# Altium project 3V3 Regulator Breakout.PrjPcb
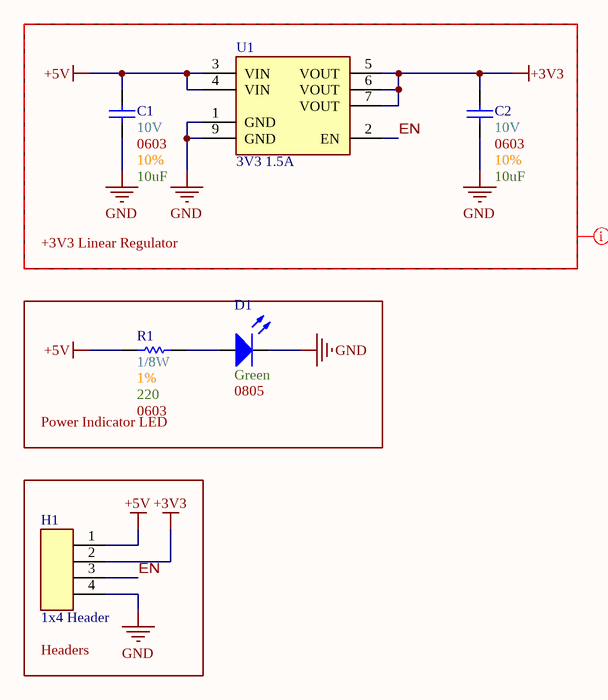
[diagram p0: Regulator.SchDoc]
1 sheet, 6 parts. Net scope: global (net labels, ports and power ports of the same name join across sheets).
Board file: Main.PcbDoc

## Sheet Regulator.SchDoc
size A; SheetNumber: 1; SheetTotal: 1

### Parts
C1  Max Voltage: 10V  Size Package: 0603  Tolerance: 10%  Capacitance: 10uF  [[Cap] SMD 0603]  (hidden comment: [Cap] 0603 10uF 10% 10V)
C2  Max Voltage: 10V  Size Package: 0603  Tolerance: 10%  Capacitance: 10uF  [[Cap] SMD 0603]  (hidden comment: [Cap] 0603 10uF 10% 10V)
D1  Color: Green  Size Package: 0805  [[LED] SMD 0805]  (hidden comment: [LED] SMD 0805 Green)
H1  1x4 Header  [[Header] 1x4 Male]
R1  Wattage: 1/8W  Tolerance: 1%  Resistance: 220  Size Package: 0603  [[Res] SMD 0603]  (hidden comment: [220] SMD 0603 1% 1/10W)
U1  3V3 1.5A  [[Linear] 3V3 1.5A]

### Blocks framed on the sheet
+3V3 Linear Regulator: C1 C2 U1
Power Indicator LED: D1 R1
Headers: H1

### Nets
+3V3: C2.2 H1.2 U1.5(VOUT) U1.6(VOUT) U1.7(VOUT)
+5V: C1.2 H1.1 R1.1 U1.3(VIN) U1.4(VIN)
GND: C1.1 C2.1 D1.2(Cathode) H1.4 U1.1(GND) U1.9(GND)
EN: H1.3 U1.2(EN)
NetD1_1: D1.1(Anode) R1.2

### Layout directives
net class Supply_Nets: +3V3, +5V, EN, GND

### Library data of the parts
C1 C2 = [Cap] 0603 10uF 10% 10V: CL10A106KP8NNNC; Supplier 1: DigiKey; Supplier Part Number 1: 1276-1192-6-ND
D1 = [LED] SMD 0805 Green: LG R971-KN-1-0-20-R18; Supplier 1: DigiKey; Supplier Part Number 1: 475-LGR971-KN-1CT-ND
H1 = [Header] 1x4 Male: 2.54mm pitch
R1 = [220] SMD 0603 1% 1/10W: CRGCQ0805F220R; Supplier 1: DigiKey; Supplier Part Number 1: A129741CT-ND
U1 = [Linear] 3V3 1.5A: AP7362A-33SP-13; Supplier 1: DigiKey; Supplier Part Number 1: AP7362A-33SP-13DICT-ND